# Altium schematic sheet TPS7A4701 and 3301.SchDoc
size A4
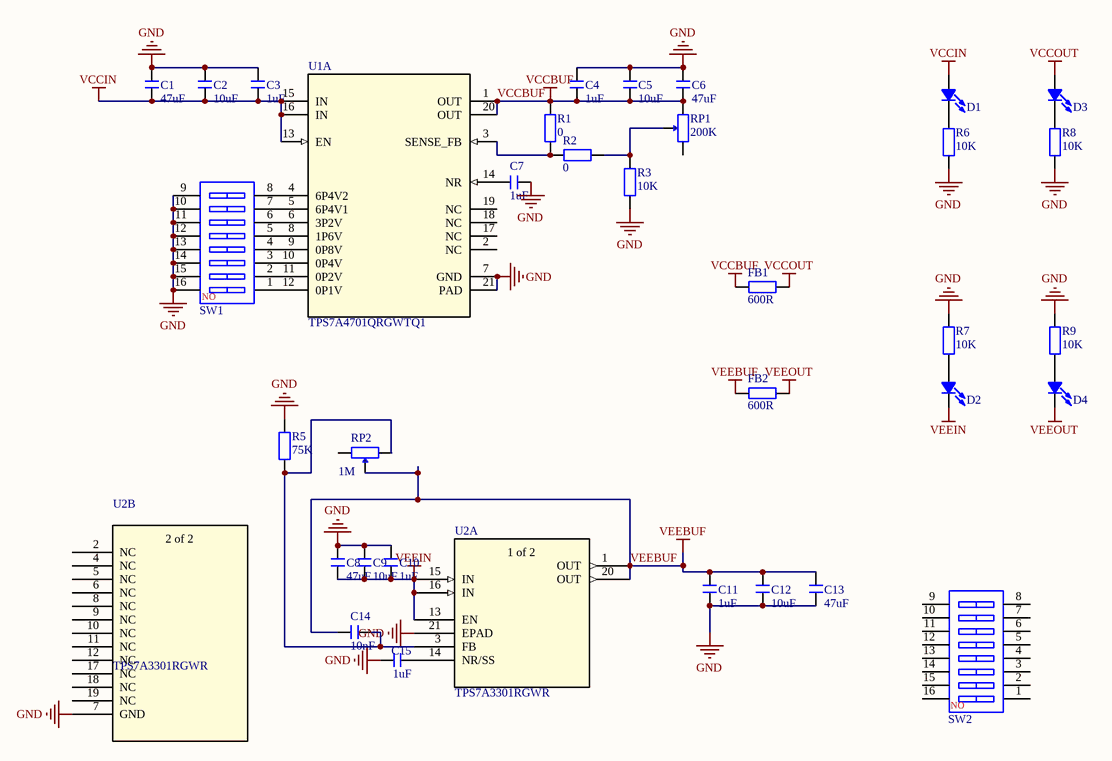
[diagram p0: TPS7A4701 and 3301.SchDoc]

## Parts
C1  47uF  [C 0603_L]
C2  10uF  [C 0603_L]
C3  1uF  [C 0603_L]
C4  1uF  [C 0603_L]
C5  10uF  [C 0603_L]
C6  47uF  [C 0603_L]
C7  1uF  [C 0603_L]
C8  47uF  [C 0603_L]
C9  10uF  [C 0603_L]
C10  1uF  [C 0603_L]
C11  1uF  [C 0603_L]
C12  10uF  [C 0603_L]
C13  47uF  [C 0603_L]
C14  10nF  [C 0603_L]
C15  1uF  [C 0603_L]
D1  LED  [Led-0805_L]  (value not drawn)
D2  LED  [Led-0805_L]  (value not drawn)
D3  LED  [Led-0805_L]  (value not drawn)
D4  LED  [Led-0805_L]  (value not drawn)
FB1  600R  [FB-0805]
FB2  600R  [FB-0805]
R1  0  [R 0603_L]
R2  0  [R 0603_L]
R3  10K  [R 0603_L]
R5  75K  [R 0603_L]
R6  10K  [R 0603_L]
R7  10K  [R 0603_L]
R8  10K  [R 0603_L]
R9  10K  [R 0603_L]
RP1  200K  [3296W]
RP2  1M  [3296W]
SW1  CSW-8P  [CSW DIP-8P]  (value not drawn)
SW2  CSW-8P  [CSW DIP-8P]  (value not drawn)
U1A  TPS7A4701QRGWTQ1  [RGW0020A]
U2  TPS7A3301RGWR  [RGW0020A]  (parts A,B of 2)

## Nets
GND: C1.2 C2.2 C3.2 C4.2 C5.2 C6.2 C7.2 C8.2 C9.2 C10.2 C11.1 C12.1 C13.1 C15.2 R3.1 R5.1 R6.1 R7.2 R8.1 R9.2 SW1.9 SW1.10 SW1.11 SW1.12 SW1.13 SW1.14 SW1.15 SW1.16 U1A.7(GND) U1A.21(PAD) U2.7(GND) U2.21(EPAD)
VCCBUF: C4.1 C5.1 C6.1 FB1.1 R1.2 RP1.1 U1A.1(OUT) U1A.20(OUT)
VCCIN: C1.1 C2.1 C3.1 D1.1 U1A.13(EN) U1A.15(IN) U1A.16(IN)
VCCOUT: D3.1 FB1.2
VEEBUF: C11.2 C12.2 C13.2 C14.2 FB2.1 RP2.2 U2.1(OUT) U2.20(OUT)
VEEIN: C8.1 C9.1 C10.1 D2.2 U2.13(EN) U2.15(IN) U2.16(IN)
VEEOUT: D4.2 FB2.2
NetC7_1: C7.1 U1A.14(NR)
NetC14_1: C14.1 R5.2 RP2.3 U2.3(FB)
NetC15_1: C15.1 U2.14(NR/SS)
NetD1_2: D1.2 R6.2
NetD2_1: D2.1 R7.1
NetD3_2: D3.2 R8.2
NetD4_1: D4.1 R9.1
NetR1_1: R1.1 R2.2 U1A.3(SENSE_FB)
NetR2_1: R2.1 R3.2 RP1.2
NetSW1_1: SW1.1 U1A.12(0P1V)
NetSW1_2: SW1.2 U1A.11(0P2V)
NetSW1_3: SW1.3 U1A.10(0P4V)
NetSW1_4: SW1.4 U1A.9(0P8V)
NetSW1_5: SW1.5 U1A.8(1P6V)
NetSW1_6: SW1.6 U1A.6(3P2V)
NetSW1_7: SW1.7 U1A.5(6P4V1)
NetSW1_8: SW1.8 U1A.4(6P4V2)

Not connected (* = marked no-connect by the designer): RP1 3; RP2 1; SW2 1 2 3 4 5 6 7 8 9 10 11 12 13 14 15 16; U1A 2(NC) 17(NC) 18(NC) 19(NC); U2 2(NC) 4(NC) 5(NC) 6(NC) 8(NC) 9(NC) 10(NC) 11(NC) 12(NC) 17(NC) 18(NC) 19(NC)

## Notes on the sheet
- (in symbol CSW-8P) NO
- (in symbol TPS7A3301RGWR_1, part A) 1 of 2
- (in symbol TPS7A3301RGWR_1, part B) 2 of 2

## Library data of the parts
C1-C15 = C: 无极性贴片电容; 版权归属: 源创客; BOM名称: 无极性贴片电容; 学习资源: www.ooocke.com
D1-D4 = LED: 发光二极管
FB1 FB2 = FB
R1-R3 R5-R9 = R: 贴片电阻; 版权归属: 源创客; BOM名称: 贴片电阻; 学习资源: www.ooocke.com
RP1 RP2 = RP-ID: 插件单联电位器; BOM名称: 插件电位器; 版权归属: 源创客; 学习资源: www.ooocke.com
SW1 SW2 = CSW-8P: 8路编码开关; 版权归属: 源创客; BOM名称: 8路编码开关; 学习资源: www.ooocke.com
U1A = TPS7A4701QRGWTQ1: No Description Available; Manufacturer: Texas Instruments; PartNumber: TPS7A4701QRGWRQ1; RefDes: RefDes; Type: DEV; Value: Value; Copyright: Copyright (C) 2021 Accelerated Designs. All rights reserved
U2 = TPS7A3301RGWR_1: Vin -3V to -36V, -1A, Ultra-Low Noise, High PSRR, Low-Dropout Linear Regulator; Manufacturer: Texas Instruments; INDUSTRY_STD_PKG_TYPE: VQFN; FAMILY_NAME: SINGLE CHANNEL LDO; PIN_COUNT: 20; PACKAGE_DESIGNATOR: RGW; Datasheet_URL: http://www.ti.com/lit/gpn/TPS7A3301; GENERIC_PART_NUMBER: TPS7A3301; Manufacturer_Part_Number: TPS7A3301RGWR; Vendor: Texas Instruments; Copyright: Copyright (C) 2021 Accelerated Designs. All rights reserved; RefDes: RefDes; Type: DEV